# EAGLE design botao (EAGLE 6.5.0)
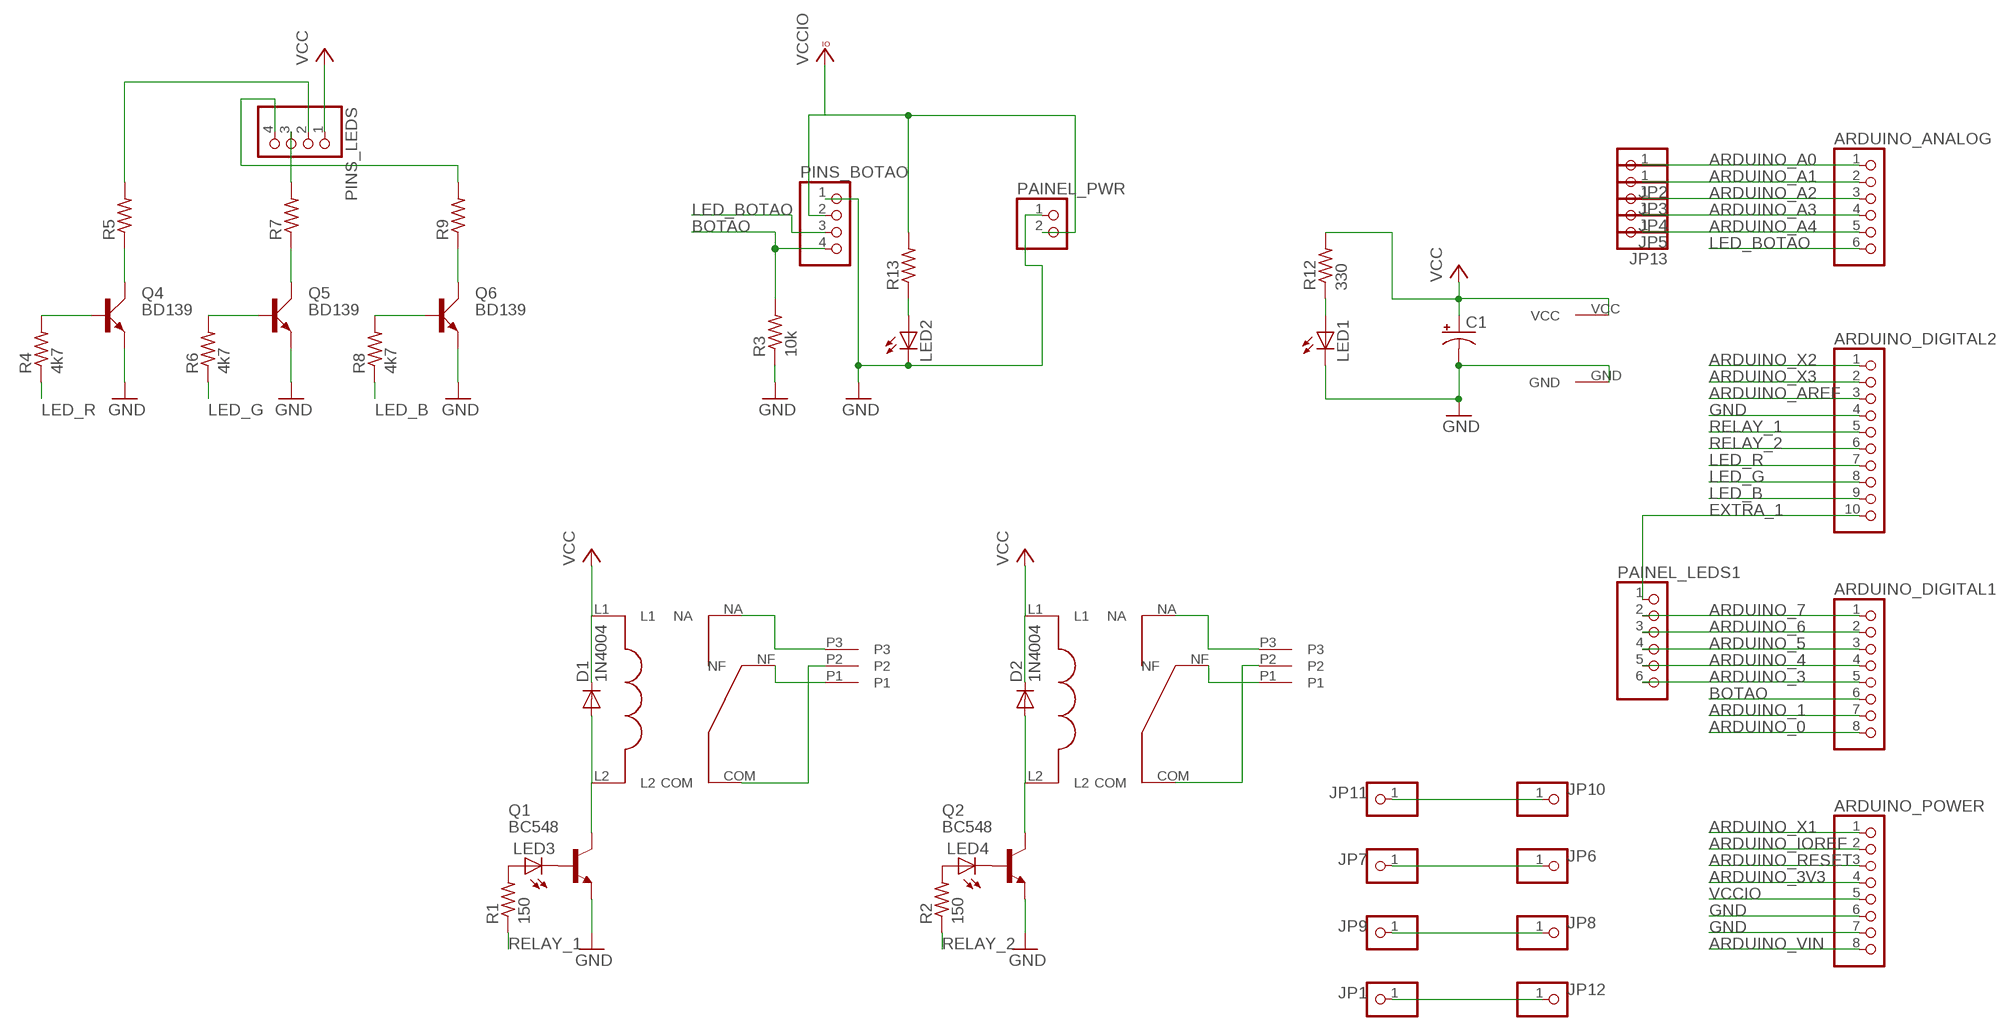
[diagram p0: schematic, sheet 1]

## Parts
ARDUINO_ANALOG  PINHD-1X6  [1X06]
ARDUINO_DIGITAL1  PINHD-1X8  [1X08]
ARDUINO_DIGITAL2  PINHD-1X10  [1X10]
ARDUINO_POWER  PINHD-1X8  [1X08]
C1  CPOL-USE5-10.5  [E5-10,5]
D1  1N4004  [DO41-10]
D2  1N4004  [DO41-10]
JP1  PINHD-1X1  [1X01]
JP2  PINHD-1X1  [1X01]
JP3  PINHD-1X1  [1X01]
JP4  PINHD-1X1  [1X01]
JP5  PINHD-1X1  [1X01]
JP6  PINHD-1X1  [1X01]
JP7  PINHD-1X1  [1X01]
JP8  PINHD-1X1  [1X01]
JP9  PINHD-1X1  [1X01]
JP10  PINHD-1X1  [1X01]
JP11  PINHD-1X1  [1X01]
JP12  PINHD-1X1  [1X01]
JP13  PINHD-1X1  [1X01]
LED1  LED5MM  [LED5MM]
LED2  LED5MM  [LED5MM]
LED3  LED5MM  [LED5MM]
LED4  LED5MM  [LED5MM]
PAINEL_LEDS1  PINHD-1X6  [1X06]
PAINEL_PWR  PINHD-1X2  [1X02]
PINS_BOTAO  PINHD-1X4  [1X04]
PINS_LEDS  PINHD-1X4  [1X04]
Q1  BC548  [TO92-EBC]
Q2  BC548  [TO92-EBC]
Q4  BD139  [TO126AV]
Q5  BD139  [TO126AV]
Q6  BD139  [TO126AV]
R1  150  R-US_0207/10  [0207/10]
R2  150  R-US_0207/10  [0207/10]
R3  10k  R-US_0207/7  [0207/7]
R4  4k7  R-US_0207/10  [0207/10]
R5  R-US_0411/15  [0411/15]
R6  4k7  R-US_0207/10  [0207/10]
R7  R-US_0411/15  [0411/15]
R8  4k7  R-US_0207/10  [0207/10]
R9  R-US_0411/15  [0411/15]
R12  330  R-US_0207/10  [0207/10]
R13  R-US_0207/7  [0207/7]
U$1  RELAY  [RELAY]
U$2  KRE3  [KRE3]
U$3  RELAY  [RELAY]
U$4  KRE3  [KRE3]
U$7  DC  [DC]

## Nets
ARDUINO_0: ARDUINO_DIGITAL1.8
ARDUINO_1: ARDUINO_DIGITAL1.7
ARDUINO_3: ARDUINO_DIGITAL1.5 PAINEL_LEDS1.6
ARDUINO_3V3: ARDUINO_POWER.4
ARDUINO_4: ARDUINO_DIGITAL1.4 PAINEL_LEDS1.5
ARDUINO_5: ARDUINO_DIGITAL1.3 PAINEL_LEDS1.4
ARDUINO_6: ARDUINO_DIGITAL1.2 PAINEL_LEDS1.3
ARDUINO_7: ARDUINO_DIGITAL1.1 PAINEL_LEDS1.2
ARDUINO_A0: ARDUINO_ANALOG.1 JP2.1
ARDUINO_A1: ARDUINO_ANALOG.2 JP3.1
ARDUINO_A2: ARDUINO_ANALOG.3 JP4.1
ARDUINO_A3: ARDUINO_ANALOG.4 JP5.1
ARDUINO_A4: ARDUINO_ANALOG.5 JP13.1
ARDUINO_AREF: ARDUINO_DIGITAL2.3
ARDUINO_IOREF: ARDUINO_POWER.2
ARDUINO_RESET: ARDUINO_POWER.3
ARDUINO_VIN: ARDUINO_POWER.8
ARDUINO_X1: ARDUINO_POWER.1
ARDUINO_X2: ARDUINO_DIGITAL2.1
ARDUINO_X3: ARDUINO_DIGITAL2.2
BOTAO: ARDUINO_DIGITAL1.6 PINS_BOTAO.4 R3.2
EXTRA_1: ARDUINO_DIGITAL2.10 PAINEL_LEDS1.1
GND: ARDUINO_DIGITAL2.4 ARDUINO_POWER.6 ARDUINO_POWER.7 C1.- LED1.K(C) LED2.K(C) PAINEL_PWR.1 PINS_BOTAO.1 Q1.E Q2.E Q4.E Q5.E Q6.E R3.1 U$7.GND
LED_B: ARDUINO_DIGITAL2.9 R8.1
LED_BOTAO: ARDUINO_ANALOG.6 PINS_BOTAO.3
LED_G: ARDUINO_DIGITAL2.8 R6.1
LED_R: ARDUINO_DIGITAL2.7 R4.1
N$1: U$1.NF U$2.P1
N$2: D1.A Q1.C U$1.L2
N$3: LED3.K(C) Q1.B
N$4: U$1.NA U$2.P3
N$5: U$1.COM U$2.P2
N$6: D2.A Q2.C U$3.L2
N$7: LED3.A R1.2
N$8: LED4.K(C) Q2.B
N$9: U$3.NA U$4.P3
N$10: U$3.COM U$4.P2
N$11: JP1.1 JP12.1
N$12: LED4.A R2.2
N$13: U$3.NF U$4.P1
N$16: Q4.B R4.2
N$17: Q4.C R5.1
N$18: PINS_LEDS.2 R5.2
N$19: Q5.B R6.2
N$20: Q5.C R7.1
N$21: PINS_LEDS.3 R7.2
N$22: Q6.B R8.2
N$23: Q6.C R9.1
N$24: PINS_LEDS.4 R9.2
N$26: LED1.A R12.1
N$28: LED2.A R13.1
RELAY_1: ARDUINO_DIGITAL2.5 R1.1
RELAY_2: ARDUINO_DIGITAL2.6 R2.1
VCC: C1.+ D1.C D2.C PINS_LEDS.1 R12.2 U$1.L1 U$3.L1
VCCIO: ARDUINO_POWER.5 PAINEL_PWR.2 PINS_BOTAO.2 R13.2
XTRA_1: JP10.1 JP11.1
XTRA_2: JP6.1 JP7.1
XTRA_3: JP8.1 JP9.1

## Power pins joined to a net without a drawn wire
VCC: U$7.VCC

## Library data of the parts
ARDUINO_ANALOG PAINEL_LEDS1 = pinhead:PINHD-1X6: PIN HEADER
ARDUINO_DIGITAL1 ARDUINO_POWER = pinhead:PINHD-1X8: PIN HEADER
ARDUINO_DIGITAL2 = pinhead:PINHD-1X10: PIN HEADER
C1 = rcl:CPOL-US: POLARIZED CAPACITOR, American symbol
D1 D2 = diode:1N4004: DIODE general purpose rectifier, 1 A
JP1-JP13 = pinhead:PINHD-1X1: PIN HEADER
LED1-LED4 = led:LED: LED OSRAM: - CHIPLED LG R971, LG N971, LY N971, LG Q971, LY Q971, LO R971, LY R971 LH N974, LH R974 LS Q976, LO Q976, LY Q976 LO Q996 - Hyper CHIPLED LW Q18S LB Q993, LB Q99A, LB R99A - SideLED LS A670, LO A670, LY A670, LG A670, LP A670 LB A673, LV A673, LT A673, LW A673 LH A674 LY A675 LS A676, LA A676, LO A676, LY A676, LW A676 LS A679, LY A679, LG A679 - Hyper Micro SIDELED® LS Y876, LA Y876, LO Y876, LY Y876 LT Y87S - SmartLED LW L88C, LW L88S LB L89C, LB L89S, LG L890 LS L89K, LO L89K, LY L89K LS L896, LA L896, LO L896, LY L896 - TOPLED LS T670, LO T670, LY T670, LG T670, LP T670 LSG T670, LSP T670, LSY T670, LOP T670, LYG T670 LG T671, LOG T671, LSG T671 LB T673, LV T673, LT T673, LW T673 LH T674 LS T676, LA T676, LO T676, LY T676, LB T676, LH T676, LSB T676, LW T676 LB T67C, LV T67C, LT T67C, LS T67K, LO T67K, LY T67K, LW E67C LS E67B, LA E67B, LO E67B, LY E67B, LB E67C, LV E67C, LT E67C LW T67C LS T679, LY T679, LG T679 LS T770, LO T770, LY T770, LG T770, LP T770 LB T773, LV T773, LT T773, LW T773 LH T774 LS E675, LA E675, LY E675, LS T675 LS T776, LA T776, LO T776, LY T776, LB T776 LHGB T686 LT T68C, LB T68C - Hyper Mini TOPLED® LB M676 - Mini TOPLED Santana® LG M470 LS M47K, LO M47K, LY M47K Source: http://www.osram.convergy.de LUXEON: - LUMILED® LXK2-PW12-R00, LXK2-PW12-S00, LXK2-PW14-U00, LXK2-PW14-V00 LXK2-PM12-R00, LXK2-PM12-S00, LXK2-PM14-U00 LXK2-PE12-Q00, LXK2-PE12-R00, LXK2-PE12-S00, LXK2-PE14-T00, LXK2-PE14-U00 LXK2-PB12-K00, LXK2-PB12-L00, LXK2-PB12-M00, LXK2-PB14-N00, LXK2-PB14-P00, LXK2-PB14-Q00 LXK2-PR12-L00, LXK2-PR12-M00, LXK2-PR14-Q00, LXK2-PR14-R00 LXK2-PD12-Q00, LXK2-PD12-R00, LXK2-PD12-S00 LXK2-PH12-R00, LXK2-PH12-S00 LXK2-PL12-P00, LXK2-PL12-Q00, LXK2-PL12-R00 Source: www.luxeon.com KINGBRIGHT: KA-3528ASYC Source: www.kingbright.com
PAINEL_PWR = pinhead:PINHD-1X2: PIN HEADER
PINS_BOTAO PINS_LEDS = pinhead:PINHD-1X4: PIN HEADER
Q1 Q2 = transistor-npn:BC548*: NPN Transistor
Q4-Q6 = transistor-power:BD139: NPN TRANSISTOR
R1-R9 R12 R13 = rcl:R-US_: RESISTOR, American symbol
U$1 U$3 = tarrafa:RELAY: relay
U$2 U$4 = tarrafa:KRE3: kre3
U$7 = tarrafa:DC: dc

## Board
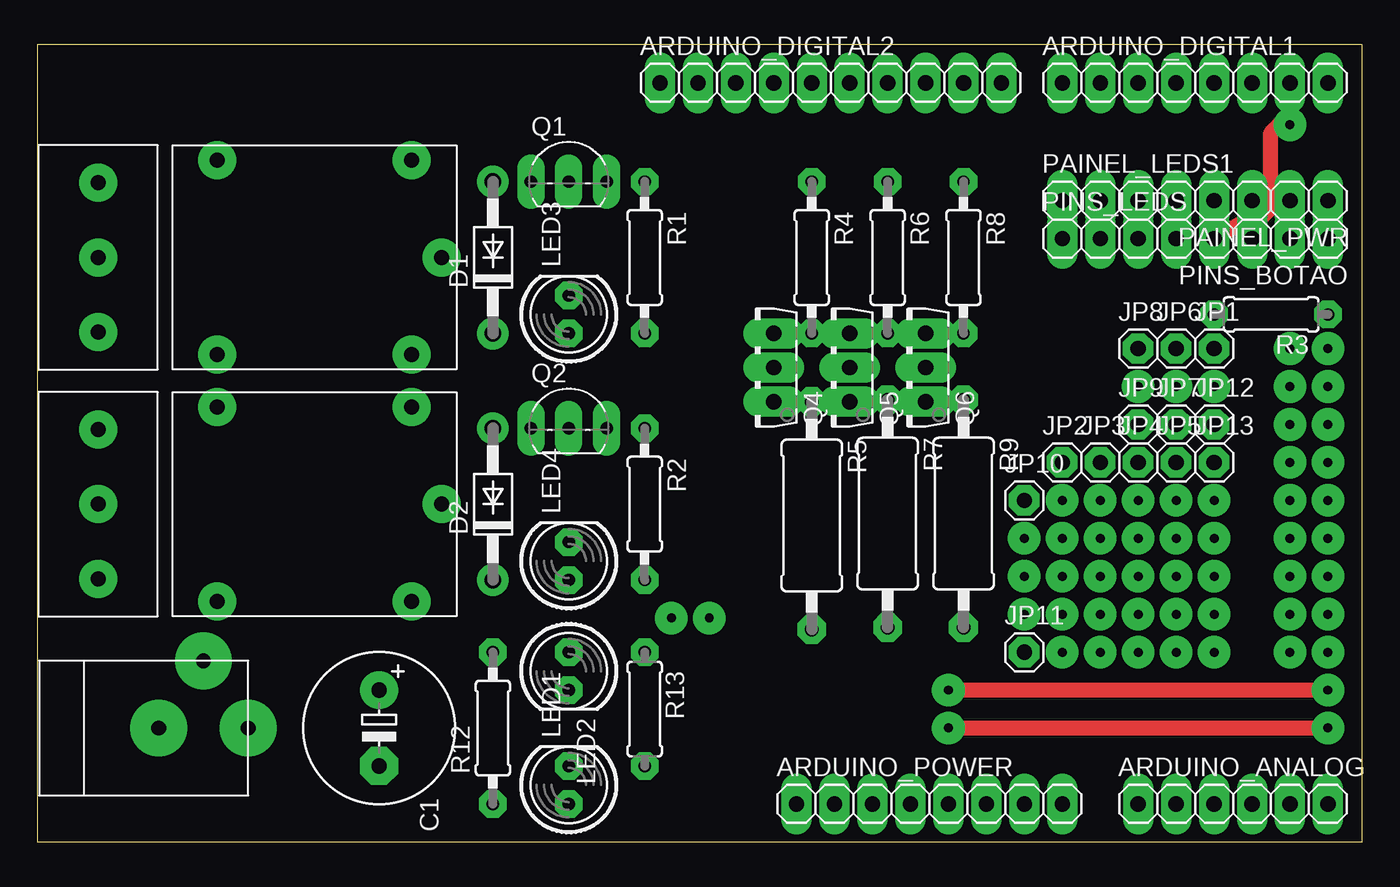
[diagram p1: board, top side]
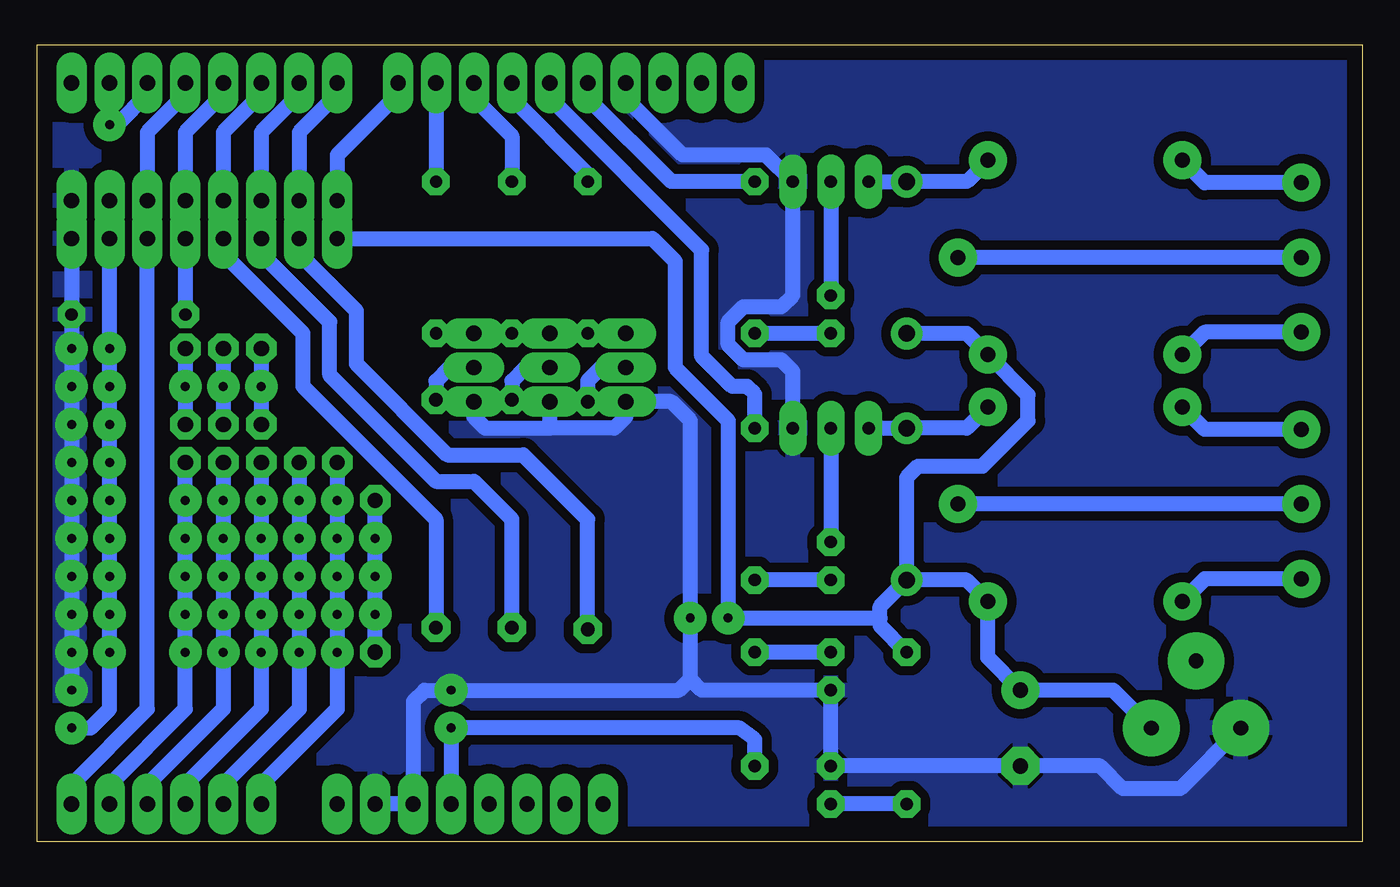
[diagram p2: board, bottom side, seen from below]

Size 88.65 x 53.34 mm. Coordinates in mm from the lower left corner, seen from the top.
Outline: 0,0 88.65,0 88.65,53.34 0,53.34 0,0
Copper layers (1*16): Top 0.035mm / dielectric 1.5mm / Bottom 0.035mm
Design rules "default *": minimum track width 10mil, minimum drill 24mil, track to track 25mil, track to pad 25mil, pad to pad 25mil, via to via 25mil, smd to smd 25mil, copper to edge 40mil, drill to drill 8mil, minimum pad ring 20mil, minimum via ring 8mil, stop-mask expansion 4mil, vias tented up to drill 2mil, thermal gap 10mil

### Footprints (pad centres in the part's own frame; a part is rotated, then mirrored left to right if it is on the bottom)
1X06 = drill 1.016 long: 1 -6.35,0; 2 -3.81,0; 3 -1.27,0; 4 1.27,0; 5 3.81,0; 6 6.35,0
1X08 = drill 1.016 long: 1 -8.89,0; 2 -6.35,0; 3 -3.81,0; 4 -1.27,0; 5 1.27,0; 6 3.81,0; 7 6.35,0; 8 8.89,0
1X10 = drill 1.016 long: 1 -11.43,0; 2 -8.89,0; 3 -6.35,0; 4 -3.81,0; 5 -1.27,0; 6 1.27,0; 7 3.81,0; 8 6.35,0; 9 8.89,0; 10 11.43,0
E5-10,5 = drill 1.016 pad 2.54: + -2.54,0 | drill 1.016 pad 2.54 octagon: - 2.54,0
DO41-10 = drill 1.118: A 5.08,0; C -5.08,0
1X01 = drill 1.016 octagon: 1 0,0
LED5MM = drill 0.813 octagon: A -1.27,0; K 1.27,0
1X02 = drill 1.016 long: 1 -1.27,0; 2 1.27,0
1X04 = drill 1.016 long: 1 -3.81,0; 2 -1.27,0; 3 1.27,0; 4 3.81,0
TO92-EBC = drill 0.813 long: B 0,-1.27; C -2.54,-1.27; E 2.54,-1.27
TO126AV = drill 1.016 long: B 2.286,-1.27; C 0,-1.27; E -2.286,-1.27
0207/10 = drill 0.813 octagon: 1 -5.08,0; 2 5.08,0
0207/7 = drill 0.813 octagon: 1 -3.81,0; 2 3.81,0
0411/15 = drill 0.914 octagon: 1 -7.62,0; 2 7.62,0
RELAY = drill 1 pad 2.54: COM -8.5,0; L1 -6.5,6.5; L2 -6.5,-6.5; NA 6.5,-6.5; NF 6.5,6.5
KRE3 = drill 1 pad 2.54: P1 -5,0; P2 0,0; P3 5,0
DC = drill 1 pad 3.81: GND 1,0; P$3 4,4.5; VCC 7,0

### Placement (x,y rotation side)
ARDUINO_ANALOG  80.01,2.54 0 top
ARDUINO_DIGITAL1  77.47,50.8 0 top
ARDUINO_DIGITAL2  53.09,50.8 0 top
ARDUINO_POWER  59.69,2.54 0 top
C1  22.86,7.62 270 top
D1  30.48,39.12 90 top
D2  30.48,22.61 90 top
JP1  78.74,33.02 0 top
JP2  68.58,25.4 0 top
JP3  71.12,25.4 0 top
JP4  73.66,25.4 0 top
JP5  76.2,25.4 0 top
JP6  76.2,33.02 0 top
JP7  76.2,27.94 0 top
JP8  73.66,33.02 0 top
JP9  73.66,27.94 0 top
JP10  66.04,22.86 0 top
JP11  66.04,12.7 0 top
JP12  78.74,27.94 0 top
JP13  78.74,25.4 0 top
LED1  35.56,3.81 90 top
LED2  35.56,11.43 270 top
LED3  35.56,35.31 90 top
LED4  35.56,18.8 90 top
PAINEL_LEDS1  74.93,42.93 0 top
PAINEL_PWR  85.09,42.93 180 top
PINS_BOTAO  82.55,40.39 180 top
PINS_LEDS  72.39,40.39 0 top
Q1  35.56,45.47 0 top
Q2  35.56,28.96 0 top
Q4  48.01,31.75 90 top
Q5  53.09,31.75 90 top
Q6  58.17,31.75 90 top
R1  40.64,39.12 270 top
R2  40.64,22.61 270 top
R3  82.55,35.31 180 top
R4  51.82,39.12 270 top
R5  51.82,21.84 270 top
R6  56.9,39.12 270 top
R7  56.9,21.97 270 top
R8  61.98,39.12 270 top
R9  61.98,21.97 270 top
R12  30.48,7.62 90 top
R13  40.64,8.89 270 top
U$1  18.54,39.12 180 top
U$2  4.06,39.12 90 top
U$3  18.54,22.61 180 top
U$4  4.06,22.61 90 top
U$7  7.11,7.62 0 top

### Tracks (layer width: path | path; a pad name or v marks a point on that pad's centre or on a via)
ARDUINO_3
  Bottom 1.016: ARDUINO_DIGITAL1.5 78.74,50.04 81.28,47.5 PAINEL_LEDS1.6
ARDUINO_4
  Bottom 1.016: ARDUINO_DIGITAL1.4 76.2,50.04 78.74,47.5 PAINEL_LEDS1.5
ARDUINO_5
  Bottom 1.016: ARDUINO_DIGITAL1.3 73.66,50.04 76.2,47.5 PAINEL_LEDS1.4
ARDUINO_6
  Bottom 1.016: ARDUINO_DIGITAL1.2 71.12,50.04 73.66,47.5 PAINEL_LEDS1.3
ARDUINO_7
  Bottom 1.016: ARDUINO_DIGITAL1.1 68.58,50.04 71.12,47.5 PAINEL_LEDS1.2
ARDUINO_A0  (via drill 0.6 pad 2.18)
  Bottom 1.016: ARDUINO_ANALOG.1 73.66,3.81 68.58,8.89 v68.58,12.7 v68.58,15.24 v68.58,17.78 v68.58,20.32 v68.58,22.86 JP2.1
ARDUINO_A1  (via drill 0.6 pad 2.18)
  Bottom 1.016: ARDUINO_ANALOG.2 76.2,3.81 71.12,8.89 v71.12,12.7 v71.12,15.24 v71.12,17.78 v71.12,20.32 v71.12,22.86 JP3.1
ARDUINO_A2  (via drill 0.6 pad 2.18)
  Bottom 1.016: ARDUINO_ANALOG.3 78.74,3.81 73.66,8.89 v73.66,12.7 v73.66,15.24 v73.66,17.78 v73.66,20.32 v73.66,22.86 JP4.1
ARDUINO_A3  (via drill 0.6 pad 2.18)
  Bottom 1.016: ARDUINO_ANALOG.4 81.28,3.81 76.2,8.89 v76.2,12.7 v76.2,15.24 v76.2,17.78 v76.2,20.32 v76.2,22.86 JP5.1
ARDUINO_A4  (via drill 0.6 pad 2.18)
  Bottom 1.016: ARDUINO_ANALOG.5 83.82,3.81 78.74,8.89 v78.74,12.7 v78.74,15.24 v78.74,17.78 v78.74,20.32 v78.74,22.86 JP13.1
BOTAO  (via drill 0.6 pad 2.18)
  Top 1.016: PINS_BOTAO.4 80.52,41.4 81.53,41.4 82.55,42.42 82.55,47.5 83.06,48.01 v83.82,48.01
  Bottom 1.016: PINS_BOTAO.4 R3.2 | ARDUINO_DIGITAL1.6 81.28,50.04 83.31,48.01 v83.82,48.01
EXTRA_1
  Bottom 1.016: ARDUINO_DIGITAL2.10 64.52,50.04 68.58,45.97 PAINEL_LEDS1.1
GND  (via drill 0.6 pad 2.18)
  Top 1.016: v86.36,10.16 v60.96,10.16
  Bottom 1.016: PAINEL_PWR.1 PINS_BOTAO.1 R3.1 v86.36,33.02 v86.36,30.48 v86.36,27.94 v86.36,25.4 v86.36,22.86 v86.36,20.32 v86.36,17.78 v86.36,15.24 v86.36,12.7 v86.36,10.16 | ARDUINO_POWER.7 ARDUINO_POWER.6 63.5,9.4 62.74,10.16 v60.96,10.16 45.72,10.16 44.96,10.92 | ARDUINO_DIGITAL2.4 49.28,49.78 45.47,45.97 39.88,45.97 Q1.E 38.1,36.58 38.86,35.81 41.4,35.81 42.42,34.8 42.42,33.27 41.4,32.26 38.86,32.26 38.1,31.5 Q2.E | 54.36,27.69 Q5.E | Q6.E 59.44,28.45 58.67,27.69 54.36,27.69 | 54.36,27.69 50.04,27.69 49.28,28.45 Q4.E 46.23,29.46 44.96,28.19 44.96,10.92 | U$7.GND 12.18,3.56 16,3.56 17.53,5.08 C1.- LED1.K LED2.K 44.2,10.16 44.96,10.92
  pour Bottom: 0,53.34 88.65,53.34 88.65,0 0,0
LED_B
  Bottom 1.016: ARDUINO_DIGITAL2.9 R8.1
LED_BOTAO
  Bottom 1.016: ARDUINO_ANALOG.6 86.36,3.81 81.28,8.89 PINS_BOTAO.3
LED_G
  Bottom 1.016: ARDUINO_DIGITAL2.8 59.44,49.78 56.9,47.24 R6.1
LED_R
  Bottom 1.016: ARDUINO_DIGITAL2.7 56.9,49.78 51.82,44.7 R4.1
N$1
  Bottom 1.016: U$2.P1 10.54,34.12 U$1.NF
N$2
  Bottom 1.016: Q1.C D1.A 26.46,44.2 U$1.L2
N$3
  Bottom 1.016: Q1.B LED3.K
N$4
  Bottom 1.016: U$2.P3 10.54,44.12 U$1.NA
N$5
  Bottom 1.016: U$2.P2 U$1.COM
N$6
  Bottom 1.016: Q2.C D2.A 26.46,27.69 U$3.L2
N$7
  Bottom 1.016: LED3.A R1.2
N$8
  Bottom 1.016: Q2.B LED4.K
N$9
  Bottom 1.016: U$4.P3 10.54,27.61 U$3.NA
N$10
  Bottom 1.016: U$4.P2 U$3.COM
N$11  (via drill 0.6 pad 2.18)
  Bottom 1.016: JP1.1 v78.74,30.48 JP12.1
N$12
  Bottom 1.016: LED4.A R2.2
N$13
  Bottom 1.016: U$4.P1 10.54,17.61 U$3.NF
N$14  (via drill 0.6 pad 2.18)
  other vias: 44.96,14.99
N$16
  Bottom 1.016: Q4.B R4.2
N$17
  Bottom 1.016: Q4.C 50.93,31.75 51.82,30.86 R5.1
N$18
  Bottom 1.016: R5.2 51.82,21.59 56.13,25.91 61.21,25.91 67.31,32 67.31,35.56 71.12,39.37 PINS_LEDS.2
N$19
  Bottom 1.016: Q5.B R6.2
N$20
  Bottom 1.016: Q5.C 56.01,31.75 56.9,30.86 R7.1
N$21
  Bottom 1.016: R7.2 56.9,21.59 59.44,24.13 61.98,24.13 69.09,31.24 69.09,34.8 73.66,39.37 PINS_LEDS.3
N$22
  Bottom 1.016: Q6.B R8.2
N$23
  Bottom 1.016: Q6.C 61.09,31.75 61.98,30.86 R9.1
N$24
  Bottom 1.016: R9.2 61.98,21.59 70.87,30.48 70.87,34.04 76.2,39.37 PINS_LEDS.4
N$26
  Bottom 1.016: R12.1 LED1.A
N$28
  Bottom 1.016: LED2.A R13.1
RELAY_1
  Bottom 1.016: ARDUINO_DIGITAL2.5 51.82,49.78 46.23,44.2 R1.1
RELAY_2
  Bottom 1.016: ARDUINO_DIGITAL2.6 54.36,49.78 44.2,39.62 44.2,32.51 42.16,30.48 41.15,30.48 40.64,29.97 R2.1
VCC  (via drill 0.6 pad 2.18)
  Bottom 1.016: D2.C 26.46,17.53 U$3.L1 25.04,12.34 C1.+ 16.65,10.16 U$7.VCC | D1.C 26.46,34.04 U$1.L1 22.35,29.93 22.35,28.19 25.4,25.15 29.72,25.15 30.48,24.38 D2.C | PINS_LEDS.1 47.5,40.39 45.97,38.86 45.97,31.75 42.42,28.19 v42.42,14.99 32.26,14.99 | D2.C 32.26,15.75 32.26,14.99 | R12.2 32.26,14.48 32.26,14.99
VCCIO  (via drill 0.6 pad 2.18)
  Top 1.016: v60.96,7.62 v86.36,7.62
  Bottom 1.016: PAINEL_PWR.2 PINS_BOTAO.2 v83.82,33.02 v83.82,30.48 v83.82,27.94 v83.82,25.4 v83.82,22.86 v83.82,20.32 v83.82,17.78 v83.82,15.24 v83.82,12.7 83.82,8.89 85.09,7.62 v86.36,7.62 | ARDUINO_POWER.5 v60.96,7.62 41.66,7.62 40.64,6.86 R13.2
XTRA_1  (via drill 0.6 pad 2.18)
  Bottom 1.016: JP11.1 v66.04,15.24 v66.04,17.78 v66.04,20.32 JP10.1
XTRA_2  (via drill 0.6 pad 2.18)
  Bottom 1.016: JP6.1 v76.2,30.48 JP7.1
XTRA_3  (via drill 0.6 pad 2.18)
  Bottom 1.016: JP8.1 v73.66,30.48 JP9.1